# Altium schematic sheet SOM_CD.SchDoc
size A; SheetNumber: 7; SheetTotal: 9
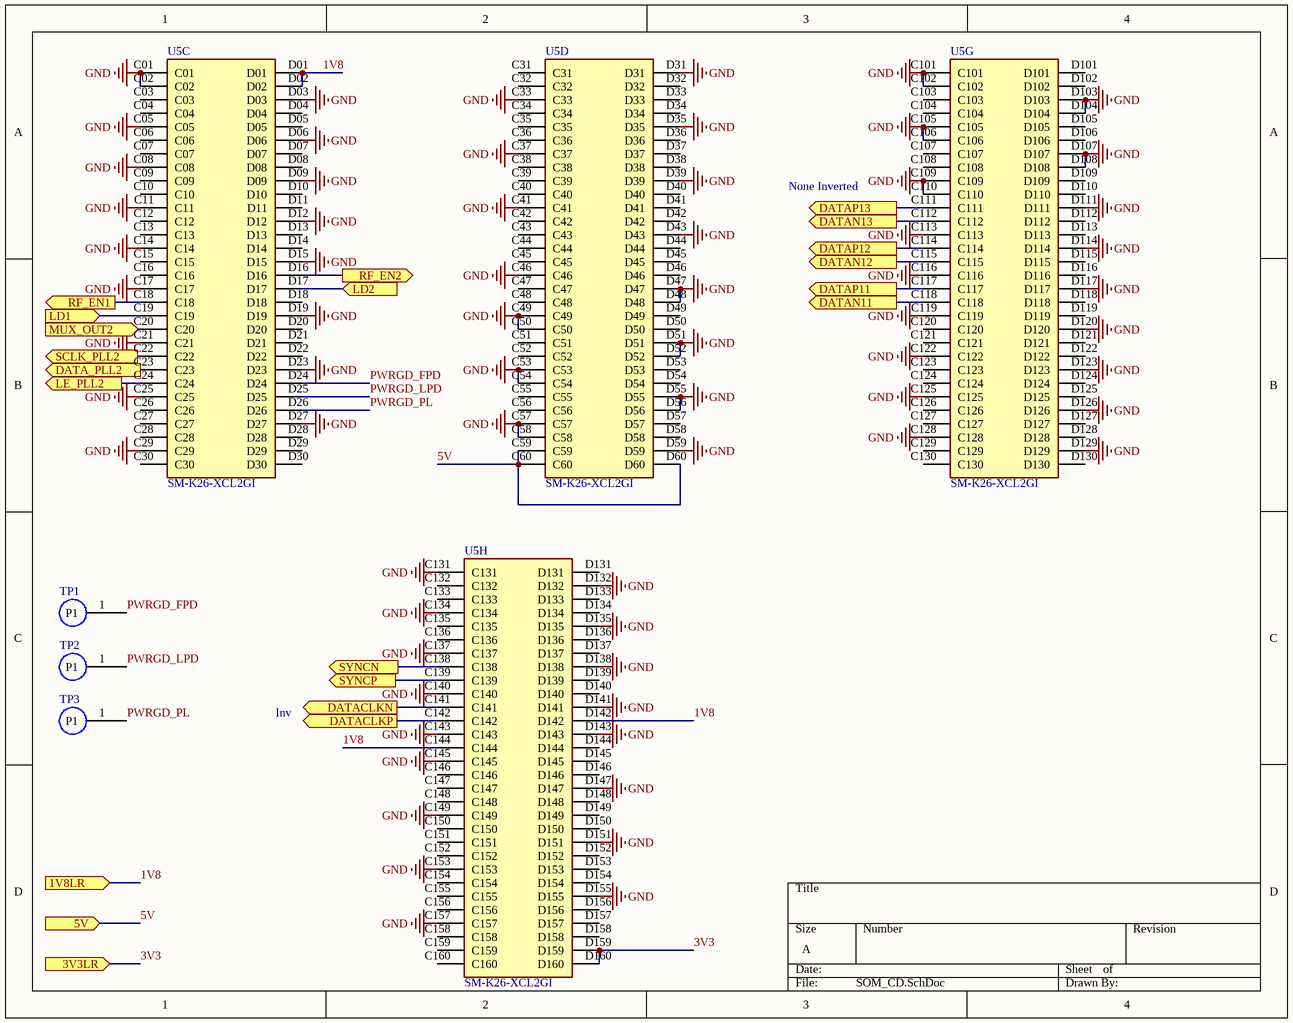
[diagram p0: SOM_CD.SchDoc]

## Parts
TP1  (no value)  [Testpoint]  (no BOM)
TP2  (no value)  [Testpoint]  (no BOM)
TP3  (no value)  [Testpoint]  (no BOM)
U5  SM-K26-XCL2GI  [MODULE_SM-K26-XCL2GI]  (parts C,D,G,H of 8)

## Ports
1V8LR (in), 3V3LR (in), 5V (in), DATA_PLL2 (out), DATACLKN (out), DATACLKP (out), DATAN11 (out), DATAN12 (out), DATAN13 (out), DATAP11 (out), DATAP12 (out), DATAP13 (out), LD1 (in), LD2 (in), LE_PLL2 (out), MUX_OUT2 (in), RF_EN1 (out), RF_EN2 (out), SCLK_PLL2 (out), SYNCN (out), SYNCP (out)

## Nets
GND: U5.C01 U5.C02 U5.C05 U5.C08 U5.C11 U5.C14 U5.C17 U5.C21 U5.C25 U5.C29 U5.C33 U5.C37 U5.C41 U5.C46 U5.C49 U5.C50 U5.C53 U5.C54 U5.C57 U5.C58 U5.C101 U5.C102 U5.C105 U5.C106 U5.C109 U5.C110 U5.C113 U5.C116 U5.C119 U5.C122 U5.C125 U5.C128 U5.C131 U5.C134 U5.C137 U5.C140 U5.C143 U5.C145 U5.C149 U5.C153 U5.C157 U5.D03 U5.D06 U5.D09 U5.D12 U5.D15 U5.D19 U5.D23 U5.D27 U5.D31 U5.D35 U5.D39 U5.D43 U5.D47 U5.D48 U5.D51 U5.D52 U5.D55 U5.D56 U5.D59 U5.D103 U5.D104 U5.D107 U5.D108 U5.D111 U5.D114 U5.D117 U5.D120 U5.D123 U5.D126 U5.D129 U5.D132 U5.D135 U5.D138 U5.D141 U5.D143 U5.D147 U5.D151 U5.D155
1V8: U5.C144 U5.D01 U5.D02 U5.D142 ; port 1V8LR
3V3: U5.D159 U5.D160 ; port 3V3LR
5V: U5.C59 U5.C60 U5.D60 ; port 5V
DATA_PLL2: U5.C23 ; port DATA_PLL2
DATACLKN: U5.C141 ; port DATACLKN
DATACLKP: U5.C142 ; port DATACLKP
DATAN11: U5.C118 ; port DATAN11
DATAN12: U5.C115 ; port DATAN12
DATAN13: U5.C112 ; port DATAN13
DATAP11: U5.C117 ; port DATAP11
DATAP12: U5.C114 ; port DATAP12
DATAP13: U5.C111 ; port DATAP13
LD1: U5.C19 ; port LD1
LD2: U5.D17 ; port LD2
LE_PLL2: U5.C24 ; port LE_PLL2
MUX_OUT2: U5.C20 ; port MUX_OUT2
PWRGD_FPD: TP1.1(P1) U5.D24
PWRGD_LPD: TP2.1(P1) U5.D25
PWRGD_PL: TP3.1(P1) U5.D26
RF_EN1: U5.C18 ; port RF_EN1
RF_EN2: U5.D16 ; port RF_EN2
SCLK_PLL2: U5.C22 ; port SCLK_PLL2
SYNCN: U5.C138 ; port SYNCN
SYNCP: U5.C139 ; port SYNCP

Not connected (* = marked no-connect by the designer): U5 C03 C04 C06 C07 C09 C10 C12 C13 C15 C16 C26 C27 C28 C30 C31 C32 C34 C35 C36 C38 C39 C40 C42 C43 C44 C45 C47 C48 C51 C52 C55 C56 C103 C104 C107 C108 C120 C121 C123 C124 C126 C127 C129 C130 C132 C133 C135 C136 C146 C147 C148 C150 C151 C152 C154 C155 C156 C158 C159 C160 D04 D05 D07 D08 D10 D11 D13 D14 D18 D20 D21 D22 D28 D29 D30 D32 D33 D34 D36 D37 D38 D40 D41 D42 D44 D45 D46 D49 D50 D53 D54 D57 D58 D101 D102 D105 D106 D109 D110 D112 D113 D115 D116 D118 D119 D121 D122 D124 D125 D127 D128 D130 D131 D133 D134 D136 D137 D139 D140 D144 D145 D146 D148 D149 D150 D152 D153 D154 D156 D157 D158

## Notes on the sheet
- None Inverted
- Inv

## Library data of the parts
TP1-TP3 = Testpoint
U5 = SM-K26-XCL2GI: ZynqÂ® UltraScale+â„¢ Kriaâ„¢ Embedded Module ARMÂ® CortexÂ®-A53 ArmÂ® CortexÂ®-R5F 533MHz, 1.333GHz 4GB 16GB eMMC, 64MB QSPI; MF: Xilinx Inc.; Package: None; SnapEDA_Link: https://www.snapeda.com/parts/SM-K26-XCL2GI/Xilinx+Inc./view-part/?ref=snap; Value: *; MP: SM-K26-XCL2GI; Check_prices: https://www.snapeda.com/parts/SM-K26-XCL2GI/Xilinx+Inc./view-part/?ref=eda; Availability: In Stock; Price: None; Purchase-URL: https://pricing.snapeda.com/search/part/SM-K26-XCL2GI/?ref=eda